# Altium schematic sheet System Control - Parallel Flash.SchDoc
size B
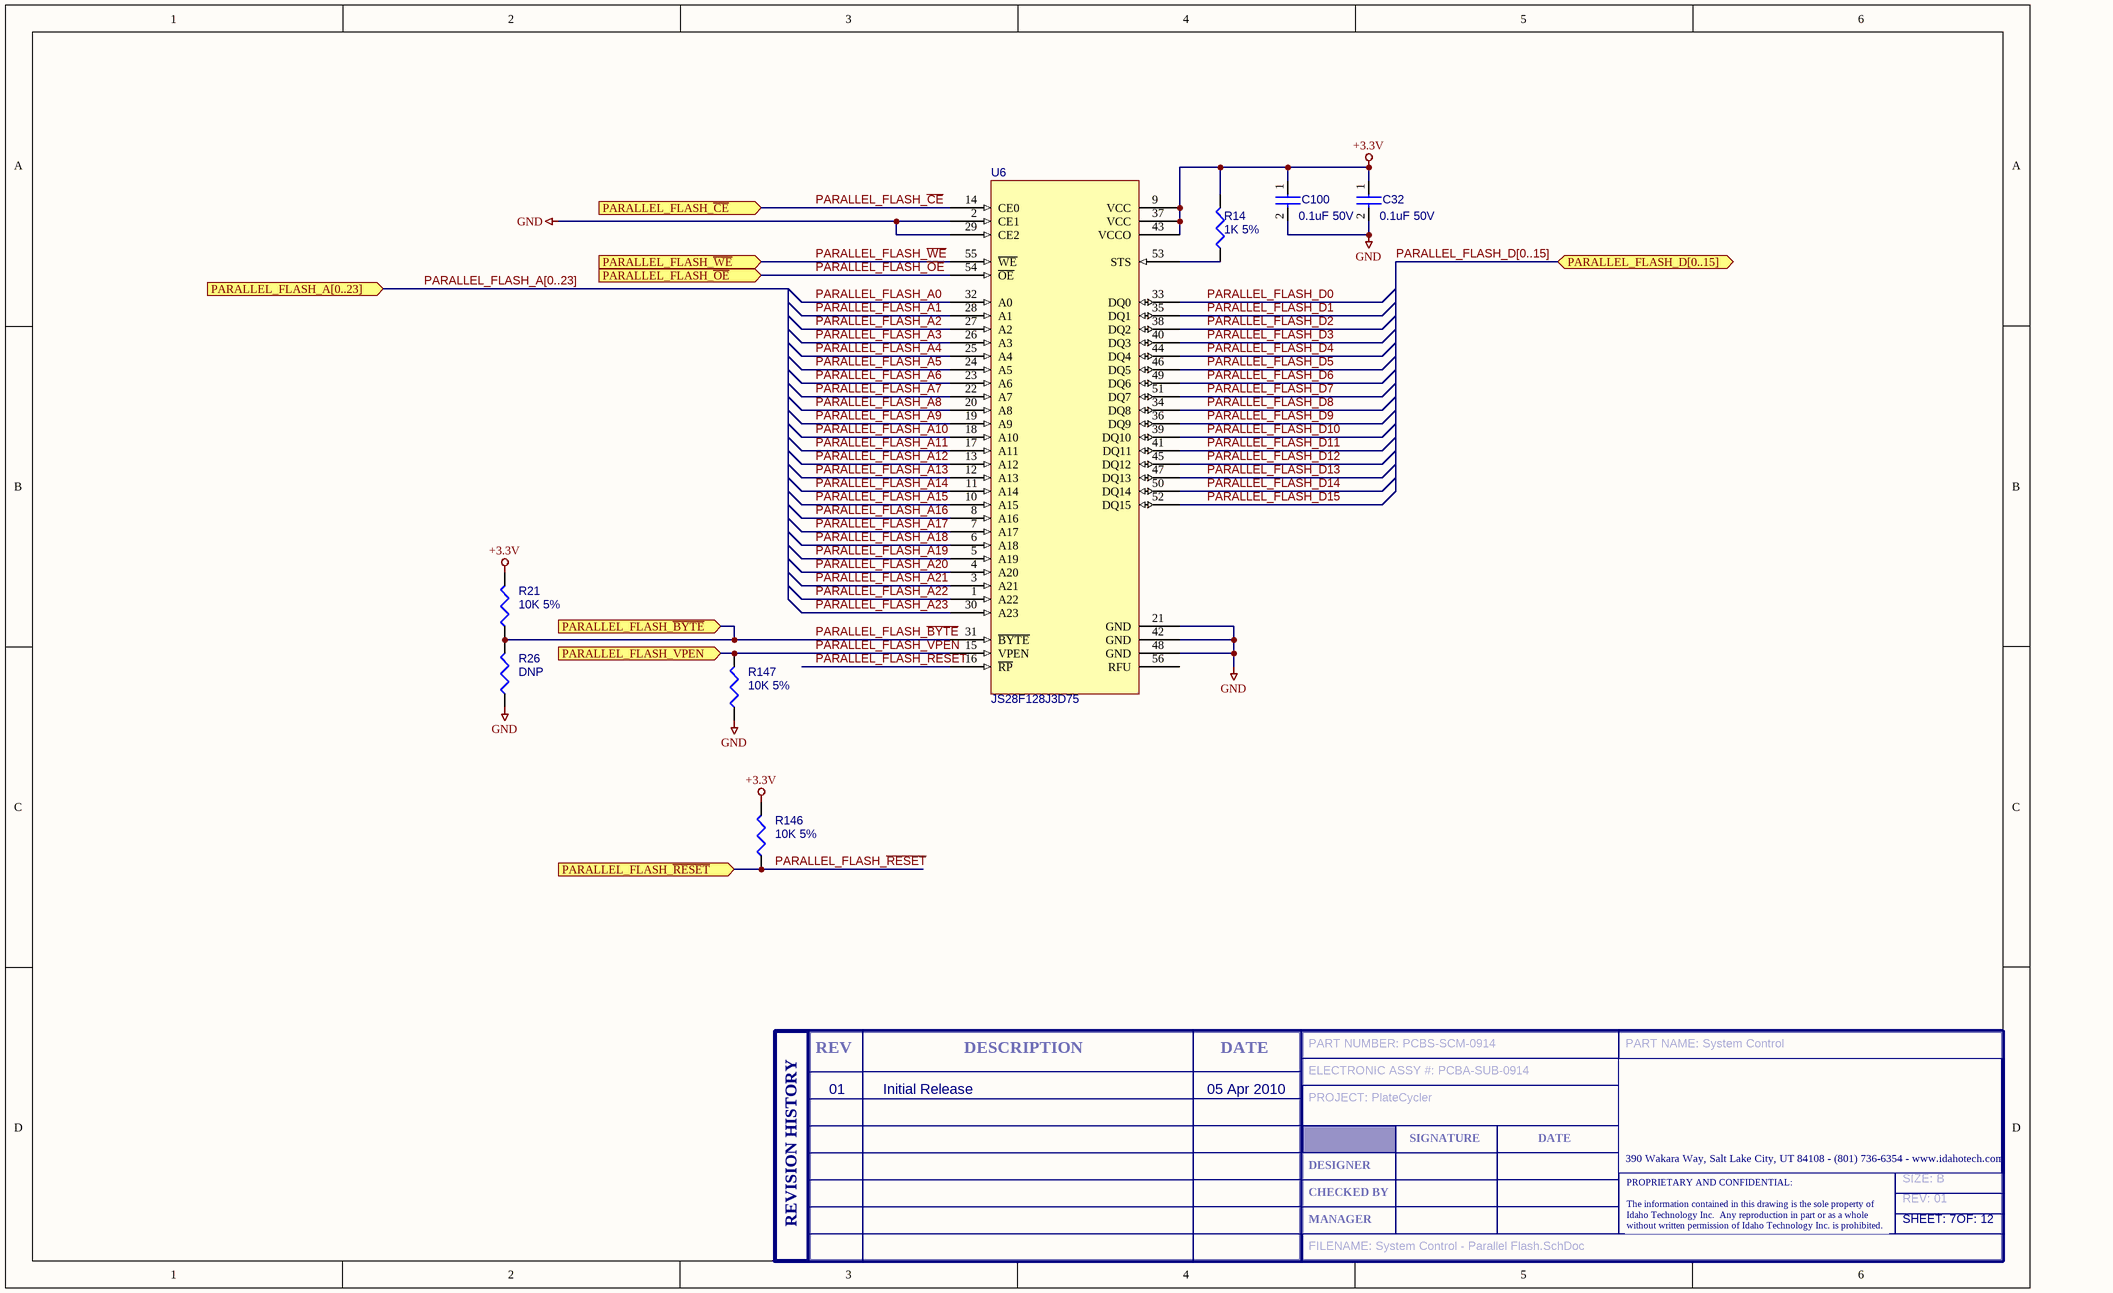
[diagram p0: System Control - Parallel Flash.SchDoc]

## Parts
C32  0.1uF 50V  [SM/C_0603]
C100  0.1uF 50V  [SM/C_0603]
R14  1K 5%  [SM/R_0603]
R21  10K 5%  [SM/R_0603]
R26  DNP  [SM/R_0603]  (no BOM)
R146  10K 5%  [SM/R_0603]
R147  10K 5%  [SM/R_0603]
T?  SIZE: B  REV: 01  FILENAME: System Control - Parallel Flash.SchDoc  PART NUMBER: PCBS-SCM-0914  PART NAME: System Control  ELECTRONIC ASSY #: PCBA-SUB-0914  PROJECT: PlateCycler  SHEET: 7  OF: 12  (hidden comment: ITI Title Block, A Size)  (graphical)
U6  JS28F128J3D75  [TSOP56]  (no BOM)

## Ports
PARALLEL_FLASH_A[0..23] (in), PARALLEL_FLASH_D[0..15] (bidir), PARALLEL_FLASH_VPEN (in), PARALLEL_FLASH_~{BYTE} (in), PARALLEL_FLASH_~{CE} (in), PARALLEL_FLASH_~{OE} (in), PARALLEL_FLASH_~{RESET} (in), PARALLEL_FLASH_~{WE} (in)

## Nets
+3.3V: C32.1 C100.1 R14.2 R21.2 R146.2 U6.9(VCC) U6.37(VCC) U6.43(VCCO)
GND: C32.2 C100.2 R26.1 R147.1 U6.2(CE1) U6.21(GND) U6.29(CE2) U6.42(GND) U6.48(GND)
PARALLEL_FLASH_A0: U6.32(A0)
PARALLEL_FLASH_A1: U6.28(A1)
PARALLEL_FLASH_A2: U6.27(A2)
PARALLEL_FLASH_A3: U6.26(A3)
PARALLEL_FLASH_A4: U6.25(A4)
PARALLEL_FLASH_A5: U6.24(A5)
PARALLEL_FLASH_A6: U6.23(A6)
PARALLEL_FLASH_A7: U6.22(A7)
PARALLEL_FLASH_A8: U6.20(A8)
PARALLEL_FLASH_A9: U6.19(A9)
PARALLEL_FLASH_A10: U6.18(A10)
PARALLEL_FLASH_A11: U6.17(A11)
PARALLEL_FLASH_A12: U6.13(A12)
PARALLEL_FLASH_A13: U6.12(A13)
PARALLEL_FLASH_A14: U6.11(A14)
PARALLEL_FLASH_A15: U6.10(A15)
PARALLEL_FLASH_A16: U6.8(A16)
PARALLEL_FLASH_A17: U6.7(A17)
PARALLEL_FLASH_A18: U6.6(A18)
PARALLEL_FLASH_A19: U6.5(A19)
PARALLEL_FLASH_A20: U6.4(A20)
PARALLEL_FLASH_A21: U6.3(A21)
PARALLEL_FLASH_A22: U6.1(A22)
PARALLEL_FLASH_A23: U6.30(A23)
PARALLEL_FLASH_~{BYTE}: R21.1 R26.2 U6.31(~{BYTE}) ; port PARALLEL_FLASH_~{BYTE}
PARALLEL_FLASH_~{CE}: U6.14(CE0) ; port PARALLEL_FLASH_~{CE}
PARALLEL_FLASH_D0: U6.33(DQ0)
PARALLEL_FLASH_D1: U6.35(DQ1)
PARALLEL_FLASH_D2: U6.38(DQ2)
PARALLEL_FLASH_D3: U6.40(DQ3)
PARALLEL_FLASH_D4: U6.44(DQ4)
PARALLEL_FLASH_D5: U6.46(DQ5)
PARALLEL_FLASH_D6: U6.49(DQ6)
PARALLEL_FLASH_D7: U6.51(DQ7)
PARALLEL_FLASH_D8: U6.34(DQ8)
PARALLEL_FLASH_D9: U6.36(DQ9)
PARALLEL_FLASH_D10: U6.39(DQ10)
PARALLEL_FLASH_D11: U6.41(DQ11)
PARALLEL_FLASH_D12: U6.45(DQ12)
PARALLEL_FLASH_D13: U6.47(DQ13)
PARALLEL_FLASH_D14: U6.50(DQ14)
PARALLEL_FLASH_D15: U6.52(DQ15)
PARALLEL_FLASH_~{OE}: U6.54(~{OE}) ; port PARALLEL_FLASH_~{OE}
PARALLEL_FLASH_~{RESET}: R146.1 U6.16(~{RP}) ; port PARALLEL_FLASH_~{RESET}
PARALLEL_FLASH_VPEN: R147.2 U6.15(VPEN) ; port PARALLEL_FLASH_VPEN
PARALLEL_FLASH_~{WE}: U6.55(~{WE}) ; port PARALLEL_FLASH_~{WE}
NetR14_1: R14.1 U6.53(STS)

Not connected (* = marked no-connect by the designer): U6 56(RFU)

## Buses and harness runs
bus PARALLEL_FLASH_A[0..23] = port PARALLEL_FLASH_A[0..23]
bus PARALLEL_FLASH_D[0..15] = port PARALLEL_FLASH_D[0..15]

## Notes on the sheet
- 01
- Initial Release
- 05 Apr 2010
- (in symbol ITI A-size Title Block and Rev Table) REV; DESCRIPTION; DATE; SIGNATURE; 390 Wakara Way, Salt Lake City, UT 84108 - (801) 736-6354 - www.idahotech.com; DESIGNER; CHECKED BY; REVISION HISTORY; MANAGER; PROPRIETARY AND CONFIDENTIAL: / The information contained in this drawing is the sole property of / Idaho Technology Inc.  Any reproduction in part or as a whole / without written permission of Idaho Technology Inc. is prohibited.

## Library data of the parts
C32 C100 = CAP NP_1: CAP CER .10UF 50V X7R 0603; Manufacturer P/N: UMK107B7104KA-T; Manufacturer: Taiyo Yuden; Vendor P/N: 587-1243-1-ND; Vendor: Digikey
R14 = R1K 5% 0603: RES 1.0K OHM 1/10W 5% 0603 SMD; Manufacturer: Panasonic; Manufacturer P/N: ERJ-3GEYJ102V; Vendor: Digikey; Vendor P/N: P1.0KGCT-ND
R21 R26 R146 R147 = R10K 5% 0603: RES 10K OHM 1/10W 5% 0603 SMD; Manufacturer: Panasonic; Manufacturer P/N: ERJ-3GEYJ103V; Vendor: Digikey; Vendor P/N: P10KGCT-ND
T? = ITI A-size Title Block and Rev Table: ITI Title Block and Rev Table, A Size
U6 = JS28F128J3D75: Flash Mem Parallel 2.7V to 3.6V 128M-Bit 16M x 8/8M x 16 75ns 56-Pin TSOP; Manufacturer: Numonyx; Vendor: Avnet; Manufacturer P/N: JS28F128J3D75; Vendor P/N: JS28F128J3D75